# EAGLE design untitled (EAGLE 6.1)
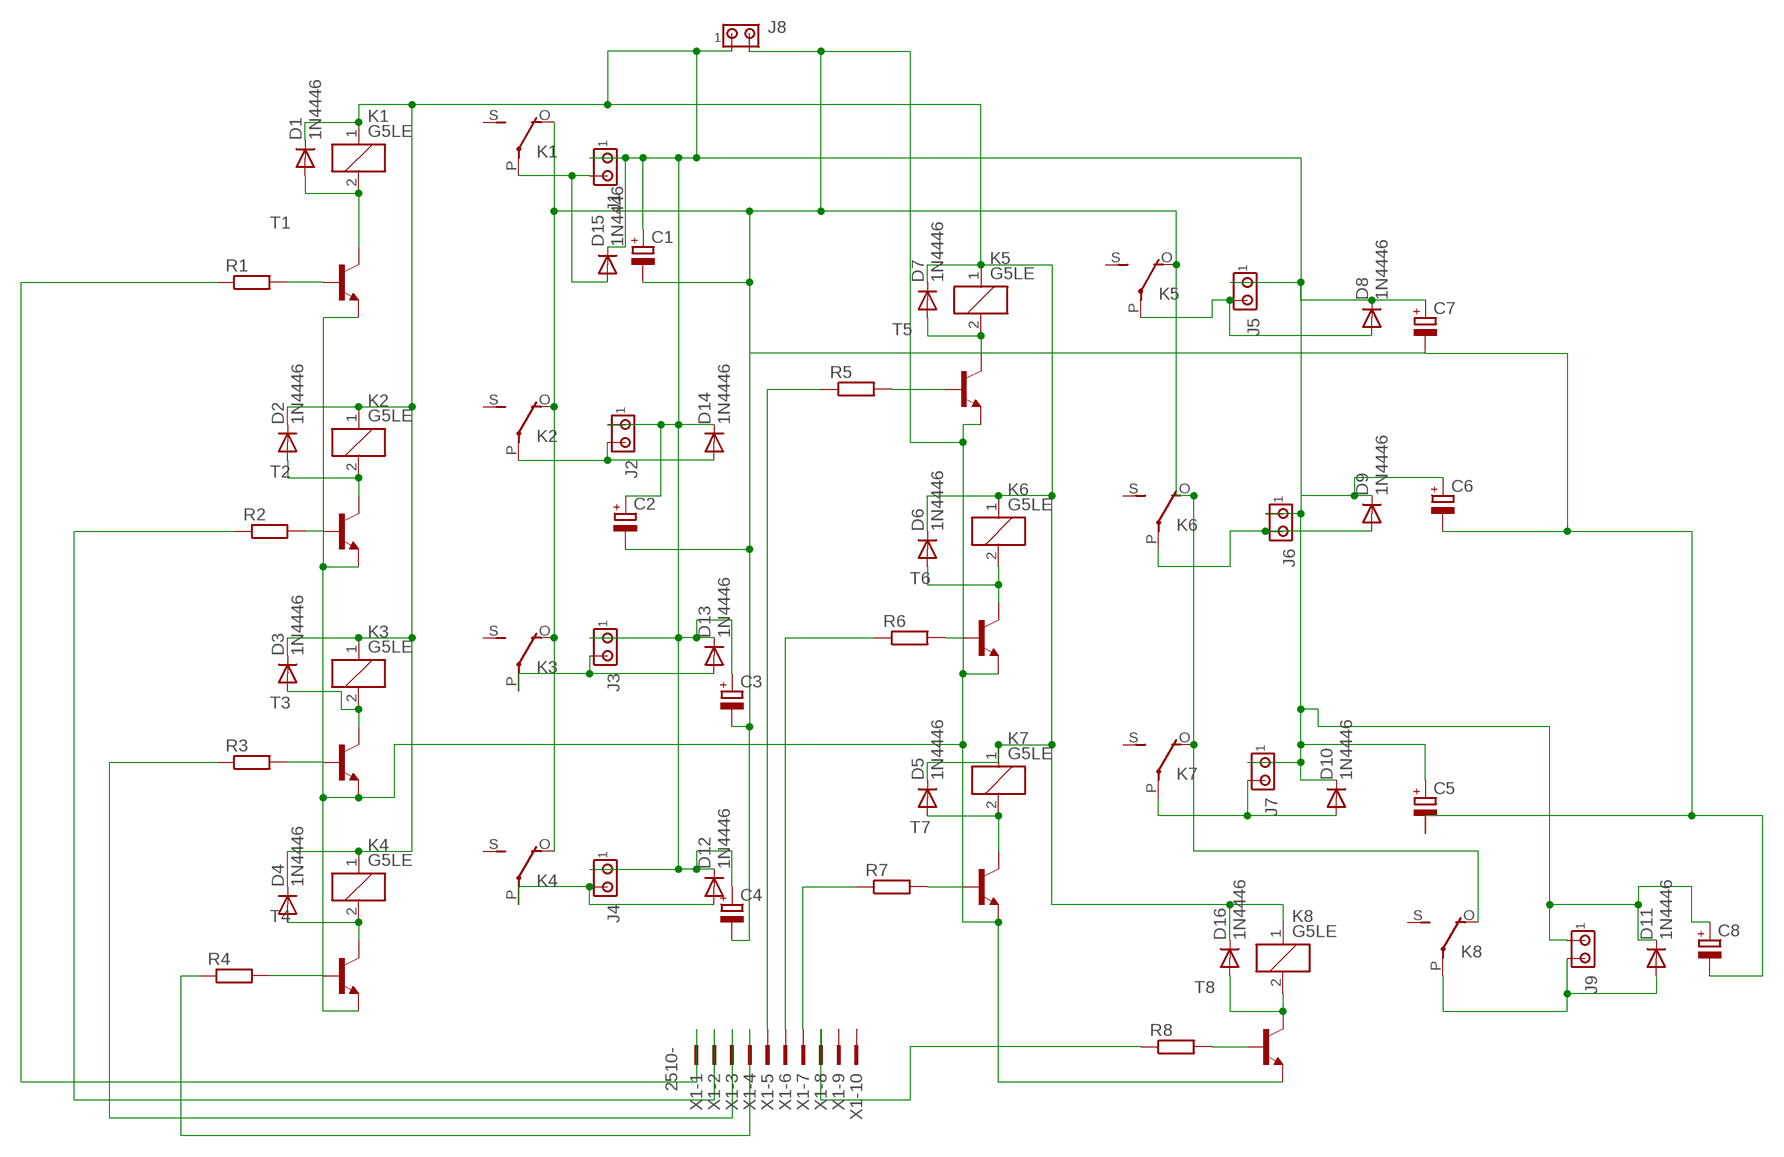
[diagram p0: schematic, sheet 1]

## Parts
C1  CPOL-EUE5-10.5  [E5-10,5]
C2  CPOL-EUE5-10.5  [E5-10,5]
C3  CPOL-EUE5-10.5  [E5-10,5]
C4  CPOL-EUE5-10.5  [E5-10,5]
C5  CPOL-EUE5-10.5  [E5-10,5]
C6  CPOL-EUE5-10.5  [E5-10,5]
C7  CPOL-EUE5-10.5  [E5-10,5]
C8  CPOL-EUE5-10.5  [E5-10,5]
D1  1N4446  [DO35-10]
D2  1N4446  [DO35-10]
D3  1N4446  [DO35-10]
D4  1N4446  [DO35-10]
D5  1N4446  [DO35-10]
D6  1N4446  [DO35-10]
D7  1N4446  [DO35-10]
D8  1N4446  [DO35-10]
D9  1N4446  [DO35-10]
D10  1N4446  [DO35-10]
D11  1N4446  [DO35-10]
D12  1N4446  [DO35-10]
D13  1N4446  [DO35-10]
D14  1N4446  [DO35-10]
D15  1N4446  [DO35-10]
D16  1N4446  [DO35-10]
J1  MTA02-156  [1X2MTA]
J2  MTA02-156  [1X2MTA]
J3  MTA02-156  [1X2MTA]
J4  MTA02-156  [1X2MTA]
J5  MTA02-156  [1X2MTA]
J6  MTA02-156  [1X2MTA]
J7  MTA02-156  [1X2MTA]
J8  MTA02-156  [1X2MTA]
J9  MTA02-156  [1X2MTA]
K1  G5LE  [G5LE]
K2  G5LE  [G5LE]
K3  G5LE  [G5LE]
K4  G5LE  [G5LE]
K5  G5LE  [G5LE]
K6  G5LE  [G5LE]
K7  G5LE  [G5LE]
K8  G5LE  [G5LE]
R1  R-EU_0207/10  [0207/10]
R2  R-EU_0207/10  [0207/10]
R3  R-EU_0207/10  [0207/10]
R4  R-EU_0207/10  [0207/10]
R5  R-EU_0207/10  [0207/10]
R6  R-EU_0207/10  [0207/10]
R7  R-EU_0207/10  [0207/10]
R8  R-EU_0207/10  [0207/10]
T1  2N5401-NPN-TO92-CBE  [TO92-CBE]
T2  2N5401-NPN-TO92-CBE  [TO92-CBE]
T3  2N5401-NPN-TO92-CBE  [TO92-CBE]
T4  2N5401-NPN-TO92-CBE  [TO92-CBE]
T5  2N5401-NPN-TO92-CBE  [TO92-CBE]
T6  2N5401-NPN-TO92-CBE  [TO92-CBE]
T7  2N5401-NPN-TO92-CBE  [TO92-CBE]
T8  2N5401-NPN-TO92-CBE  [TO92-CBE]
X1  2510-  [PAK100/2500-10]

## Nets
N$1: D4.A K4.2 T4.C
N$2: R4.2 T4.B
N$3: R3.2 T3.B
N$4: D3.A K3.2 T3.C
N$5: D2.A K2.2 T2.C
N$6: R2.2 T2.B
N$7: D1.A K1.2 T1.C
N$8: R1.2 T1.B
N$9: R5.2 T5.B
N$10: D7.A K5.2 T5.C
N$11: R6.2 T6.B
N$12: D6.A K6.2 T6.C
N$13: D5.A K7.2 T7.C
N$14: R7.2 T7.B
N$15: R8.2 T8.B
N$16: D11.A J9.2 K8.P(2:P)
N$17: D14.A J2.2 K2.P(2:P)
N$18: R1.1 X1.1
N$19: R2.1 X1.2
N$20: R3.1 X1.3
N$21: R4.1 X1.4
N$22: R7.1 X1.7
N$23: R6.1 X1.6
N$24: R5.1 X1.5
N$25: D13.A J3.2 K3.P(2:P)
N$26: D8.A J5.2 K5.P(2:P)
N$27: D9.A J6.2 K6.P(2:P)
N$28: D10.A J7.2 K7.P(2:P)
N$29: D15.A J1.2 K1.P(2:P)
N$30: D12.A J4.2 K4.P(2:P)
N$31: D16.A K8.2 T8.C
N$32: C1.- C2.- C3.- C4.- C5.- C6.- C7.- C8.- J8.2 K1.O(2:O) K2.O(2:O) K3.O(2:O) K4.O(2:O) K5.O(2:O) K6.O(2:O) K7.O(2:O) K8.O(2:O) T1.E T2.E T3.E T4.E T5.E T6.E T7.E T8.E
N$33: R8.1 X1.8
N$34: C1.+ C2.+ C3.+ C4.+ C5.+ C6.+ C7.+ C8.+ D1.C D2.C D3.C D4.C D5.C D6.C D7.C D8.C D9.C D10.C D11.C D12.C D13.C D14.C D15.C D16.C J1.1 J2.1 J3.1 J4.1 J5.1 J6.1 J7.1 J8.1 J9.1 K1.1 K2.1 K3.1 K4.1 K5.1 K6.1 K7.1 K8.1
Unconnected: K1.S(2:S) K2.S(2:S) K3.S(2:S) K4.S(2:S) K5.S(2:S) K6.S(2:S) K7.S(2:S) K8.S(2:S) X1.9 X1.10

## Library data of the parts
C1-C8 = qfm-trx1-24g:CPOL-EU: POLARIZED CAPACITOR, European symbol
D1-D16 = diode:1N4446: DIODE high speed (Philips)
J1-J9 = con-amp:MTA02-156: AMP connector
K1-K8 = relay:G5LE: RELAY 1 x switch, 10 A/120 V AC, 8 A/30 V DC, Omron; OC_FARNELL: unknown; OC_NEWARK: unknown
R1-R8 = resistor:R-EU_: RESISTOR, European symbol
T1-T8 = transistor:*-NPN-: NPN Transistror BF959 corrected 2008.03.06
X1 = con-3m:2510-: 3M (TM) Pak 100 4-Wall Header Source: 3M; MF: 3M; MPN: 2510-6002UB; OC_FARNELL: 9838244; OC_NEWARK: 46F4725

## Board
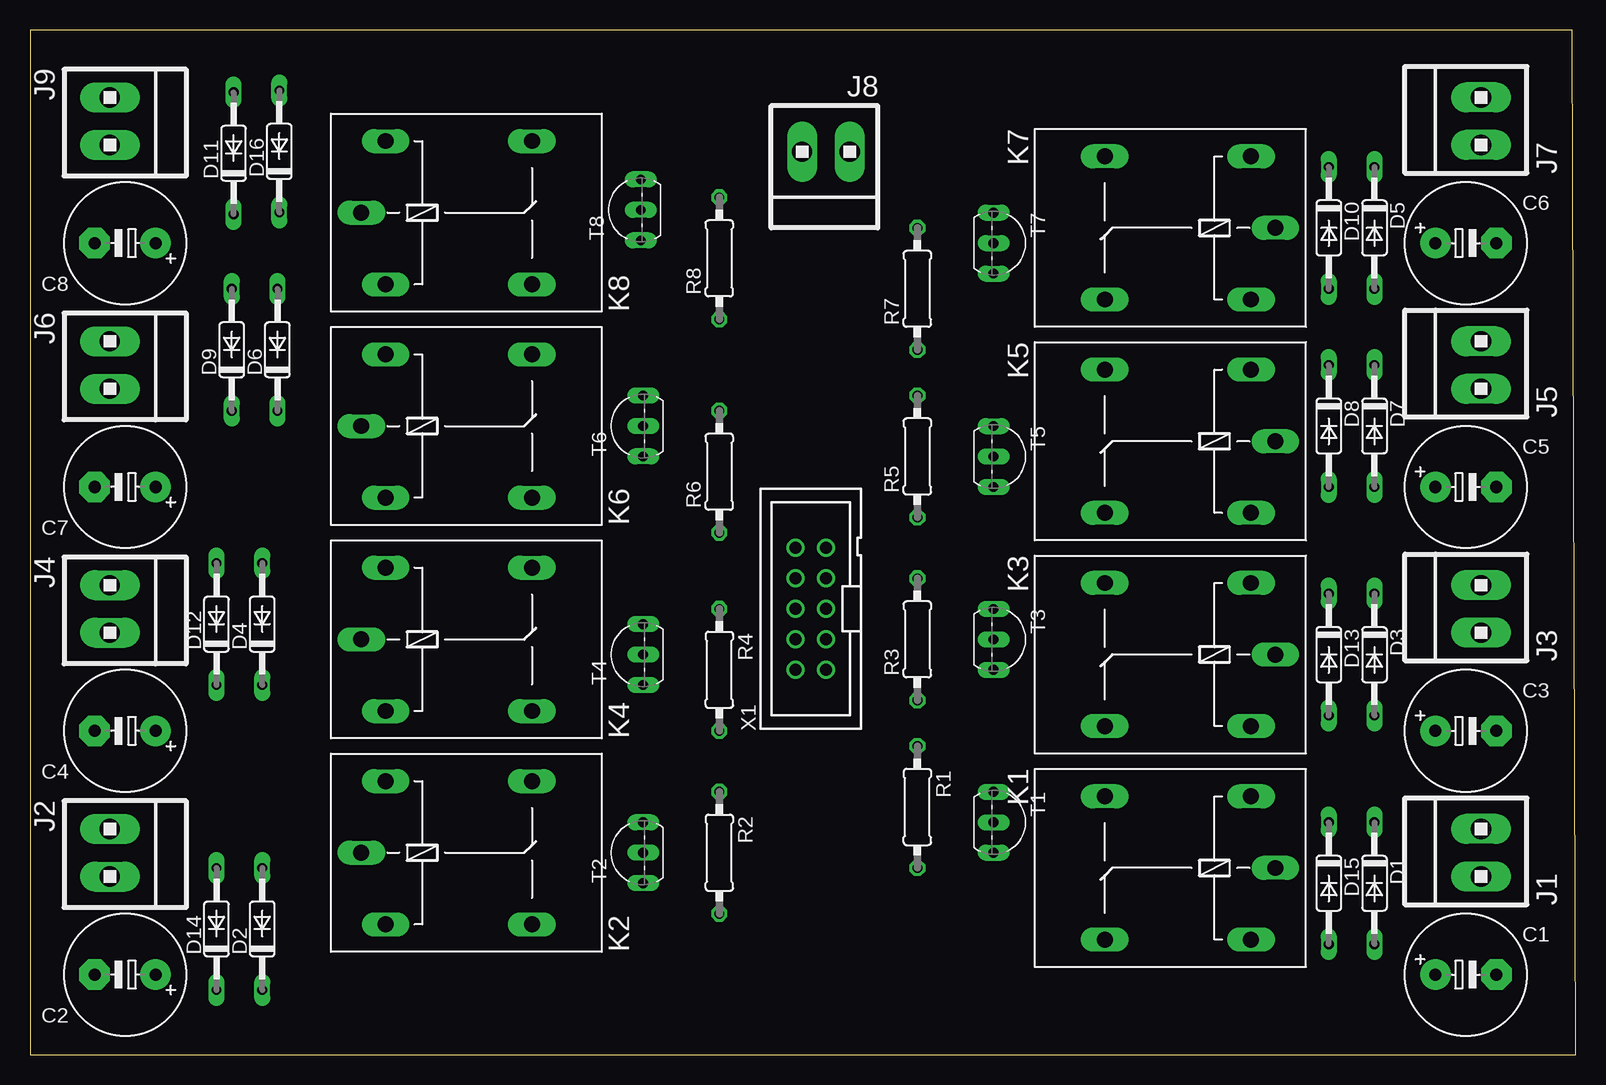
[diagram p1: board, top side]
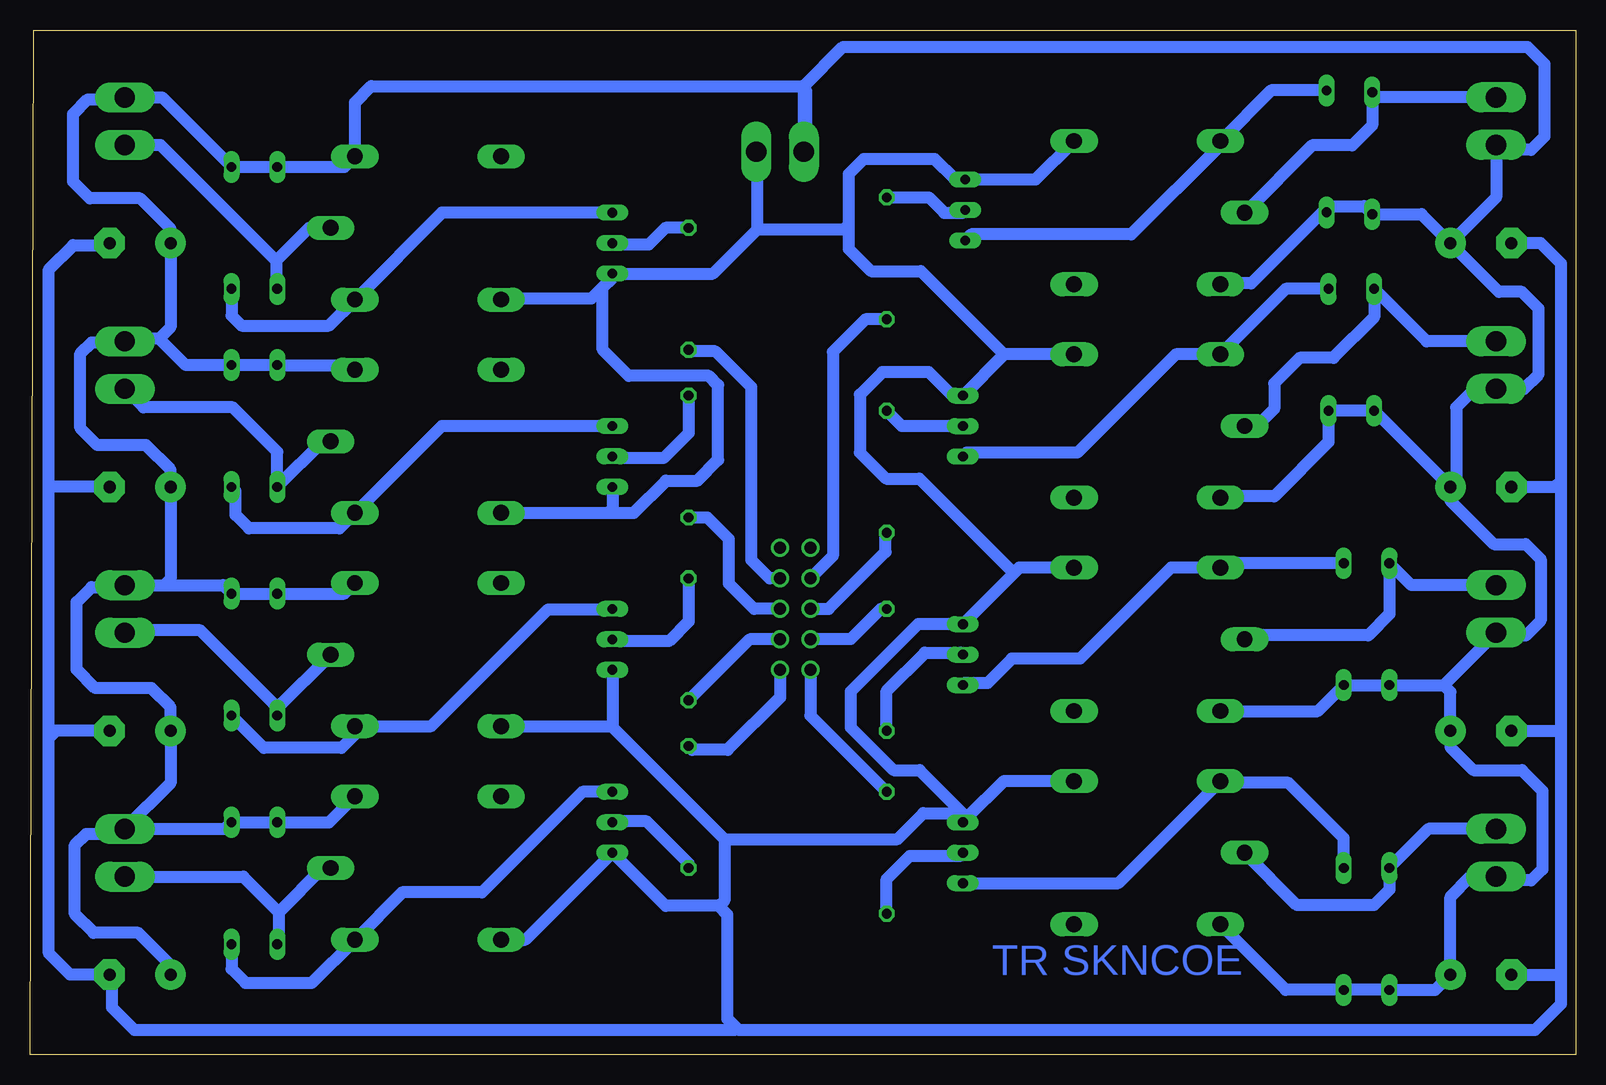
[diagram p2: board, bottom side, seen from below]

Size 128.87 x 85.38 mm. Coordinates in mm from the lower left corner, seen from the top.
Outline: 0,0 128.87,0 128.56,85.38 0,85.38 0,0
Copper layers (1*16): Top 0.035mm / dielectric 1.5mm / Bottom 0.035mm
Design rules: minimum track width 10mil, minimum drill 24mil, track to track 8mil, track to pad 8mil, pad to pad 8mil, via to via 8mil, smd to smd 8mil, copper to edge 40mil, drill to drill 8mil, minimum pad ring 10mil, minimum via ring 8mil, stop-mask expansion 4mil, vias tented up to drill 0mil, thermal gap 10mil

### Footprints (pad centres in the part's own frame; a part is rotated, then mirrored left to right if it is on the bottom)
E5-10,5 = drill 1.016 pad 2.54: + -2.54,0 | drill 1.016 pad 2.54 octagon: - 2.54,0
DO35-10 = drill 0.813 long: A 5.08,0; C -5.08,0
1X2MTA = drill 1.676 long: 1 1.981,0; 2 -1.981,0
G5LE = drill 1.321 long: 1 -7.493,-5.969; 2 -7.493,5.969; O 4.699,5.969; P -9.525,0; S 4.699,-5.969
0207/10 = drill 0.813 octagon: 1 -5.08,0; 2 5.08,0
TO92-CBE = drill 0.813 long: B 0,0; C -2.54,0; E 2.54,0
PAK100/2500-10 = drill 1 pad 1.422: 1 -5.08,-1.27; 2 -5.08,1.27; 3 -2.54,-1.27; 4 -2.54,1.27; 5 0,-1.27; 6 0,1.27; 7 2.54,-1.27; 8 2.54,1.27; 9 5.08,-1.27; 10 5.08,1.27

### Placement (x,y rotation side)
C1  119.69,6.66 0 top
C2  7.93,6.66 180 top
C3  119.69,26.98 0 top
C4  7.93,26.98 180 top
C5  119.69,47.3 0 top
C6  119.69,67.62 0 top
C7  7.93,47.3 180 top
C8  7.93,67.62 180 top
D1  112.07,14.28 270 top
D2  19.36,10.47 90 top
D3  112.07,33.33 270 top
D4  19.36,35.87 90 top
D5  112.07,68.89 270 top
D6  20.63,58.73 90 top
D7  112.07,52.38 270 top
D8  108.26,52.38 270 top
D9  16.82,58.73 90 top
D10  108.26,68.89 270 top
D11  16.98,75.11 90 top
D12  15.55,35.87 90 top
D13  108.26,33.33 270 top
D14  15.55,10.47 90 top
D15  108.26,14.28 270 top
D16  20.79,75.27 90 top
J1  120.96,16.82 90 top
J2  6.66,16.82 270 top
J3  120.96,37.14 90 top
J4  6.66,37.14 270 top
J5  120.96,57.46 90 top
J6  6.66,57.46 270 top
J7  120.96,77.78 90 top
J8  66.35,75.24 180 top
J9  6.66,77.78 270 top
K1  94.29,15.55 180 top
K2  37.14,16.82 0 top
K3  94.29,33.33 180 top
K4  37.14,34.6 0 top
K5  94.29,51.11 180 top
K6  37.14,52.38 0 top
K7  94.29,68.89 180 top
K8  37.14,70.16 0 top
R1  73.97,20.63 270 top
R2  57.46,16.82 270 top
R3  73.97,34.6 90 top
R4  57.46,32.06 270 top
R5  73.97,49.84 90 top
R6  57.46,48.57 90 top
R7  73.97,63.81 90 top
R8  57.46,66.35 90 top
T1  80.32,19.36 270 top
T2  51.11,16.82 90 top
T3  80.32,34.6 270 top
T4  51.11,33.33 90 top
T5  80.32,49.84 270 top
T6  51.11,52.38 90 top
T7  80.32,67.62 270 top
T8  50.91,70.39 90 top
X1  65.08,37.14 90 top

### Tracks (layer width: path | path; a pad name or v marks a point on that pad's centre or on a via)
N$1
  Bottom 1.016: D4.A 29.27,40.95 K4.2 33.76,40.57 41.34,32.99 47.02,32.99 49.05,30.96 50.94,30.96 T4.C
N$2
  Bottom 1.016: R4.2 57.46,30.32 54.28,33.5 51.28,33.5 T4.B
N$3
  Bottom 1.016: R3.2 73.97,36.09 75.61,34.45 80.17,34.45 T3.B
N$4
  Bottom 1.016: D3.A 109.38,25.56 102.9,25.56 101.78,26.68 K3.2 95.42,27.36 85.68,37.1 80.36,37.1 T3.C
N$5
  Bottom 1.016: D2.A 19.36,18.04 23.96,22.64 29.5,22.64 K2.2 38.16,14.28 T2.C
N$6
  Bottom 1.016: R2.2 57.46,14.62 55.52,16.56 51.37,16.56 T2.B
N$7
  Bottom 1.016: D1.A 112.07,7.15 110.9,5.97 105.39,5.97 K1.2 97.85,13.51 91.2,13.51 82.81,21.9 T1.C
N$8
  Bottom 1.016: R1.2 73.97,15.93 77.47,19.43 80.26,19.43 T1.B
N$9
  Bottom 1.016: R5.2 73.97,51.8 76.06,49.71 80.19,49.71 T5.B
N$10
  Bottom 1.016: T5.C 94.54,52.38 K5.2 103.07,43.86 110.61,43.86 111.74,44.98 111.74,46.97 D7.A
N$11
  Bottom 1.016: T6.B 56.19,52.38 R6.2
N$12
  Bottom 1.016: D6.A 24.19,63.81 K6.2 33.37,58.35 41.11,50.61 | 41.11,50.61 | 41.11,50.61 41.56,50.16 50.79,50.16 T6.C
N$13
  Bottom 1.016: D5.A 112.07,61.58 111.23,60.74 103.96,60.74 K7.2 94.54,70.16 T7.C
N$14
  Bottom 1.016: R7.2 75.9,68.89 77.3,67.5 80.2,67.5 T7.B
N$15
  Bottom 1.016: R8.2 53.94,71.43 52.65,70.14 51.15,70.14 T8.B
N$16
  Bottom 1.016: K8.P 22.01,75.77 18.65,75.77 16.98,77.44 D11.A 16.55,79.76 J9.2
N$17
  Bottom 1.016: J2.2 12.3,18.8 D14.A 15.55,13.75 16.84,12.46 23.26,12.46 K2.P
N$18
  Bottom 1.016: X1.1 66.35,29.76 70.71,25.39 73.65,25.39 R1.1
N$19
  Bottom 1.016: X1.2 63.81,28.25 R2.1
N$20
  Bottom 1.016: X1.3 68.89,34.6 R3.1
N$21
  Bottom 1.016: R4.1 57.95,37.14 60.47,34.62 63.79,34.62 X1.4
N$22
  Bottom 1.016: X1.7 67.22,39.68 68.74,41.21 68.74,55.62 71.73,58.6 73.84,58.6 R7.1
N$23
  Bottom 1.016: X1.6 62.29,37.14 57.54,41.89 57.54,43.41 R6.1
N$24
  Bottom 1.016: X1.5 68.5,37.14 70.6,39.24 70.6,42.96 72.4,44.76 R5.1
N$25
  Bottom 1.016: K3.P 108.26,28.89 D13.A 108.26,28.95 114.67,35.36 120.77,35.36 J3.2
N$26
  Bottom 1.016: K5.P 104.45,51.11 D8.A 108.26,50.23 111.96,53.93 119.41,53.93 J5.2
N$27
  Bottom 1.016: J6.2 12.45,59.44 D9.A 16.82,61.46 20.21,58.06 23.04,58.06 25.16,55.94 25.16,53.82 26.52,52.46 27.54,52.46 K6.P
N$28
  Bottom 1.016: J7.2 118.02,75.8 108.36,66.15 | 108.36,66.15 108.36,63.91 D10.A | K7.P 105.62,68.89 108.36,66.15
N$29
  Bottom 1.016: K1.P 104.47,15.55 108.14,11.88 | 108.14,11.88 108.14,9.32 D15.A | J1.2 111.1,14.84 108.14,11.88
N$30
  Bottom 1.016: J4.2 13.72,39.12 D12.A 15.55,36.72 17.33,34.94 27.28,34.94 K4.P
N$31
  Bottom 1.016: T8.C 50.41,68.34 37.06,68.34 29.65,75.75 K8.2 25.43,80.35 D16.A
N$32
  Bottom 1.016: K2.O 47.68,22.79 50.75,19.72 | 50.75,19.72 T2.E | K4.O 46.41,40.57 46.86,40.12 | 46.86,40.12 T4.E 54.83,35.87 60.47,30.24 60.47,27.27 56.89,23.7 54.72,23.7 51.22,20.19 | K6.O 47.68,58.35 | 47.68,58.35 T6.E 51.99,54.92 53.94,56.87 57.82,56.87 59.69,55 59.69,50.17 57.51,47.99 54.73,47.99 46.86,40.12 | K8.O 45.04,72.93 T8.E 51.77,72.93 53.47,74.62 59.38,74.62 60.62,73.38 60.62,69.17 | K1.O 87.56,9.58 T1.E 75.89,12.39 71.45,12.39 | K3.O 80.4,27.36 80.32,27.29 | 80.32,27.29 70.99,17.96 | 70.99,17.96 70.99,12.84 71.45,12.39 | T3.E 80.32,27.29 | K5.O 80.67,45.14 | 80.67,45.14 78.55,45.14 75.86,47.84 73.22,47.84 71.5,49.55 71.5,55.78 72.28,56.56 78.96,56.56 81.14,58.74 81.14,63.93 | 81.14,63.93 82.08,62.99 89.52,62.99 K7.O | 68.24,68.79 71.95,65.08 T7.E 80.32,64.76 81.14,63.93 | 68.24,68.79 68.24,75.15 J8.2 | 127.31,26.34 127.31,8.43 125.54,6.66 C1.- 122.02,6.45 122.02,3.91 120.16,2.05 70.1,2.05 69.95,2.21 | 127.31,26.34 127.31,47.21 | 127.31,47.21 127.31,65.44 125.29,67.46 122.39,67.46 C6.- | C5.- 127.22,47.3 127.31,47.21 | 127.31,26.34 126.67,26.98 C3.- 127.01,26.98 127.15,27.12 | C2.- 1.35,6.66 1.24,6.77 | 1.24,6.77 1.24,4.22 3.42,2.05 69.79,2.05 69.95,2.21 | 1.24,6.77 1.24,26.81 | 1.24,26.81 1.24,26.97 | 1.24,26.97 1.24,47.84 | 1.24,47.84 1.24,65.91 2.95,67.62 C8.- | C7.- 1.78,47.3 1.24,47.84 | 1.24,26.81 1.41,26.98 C4.- 1.26,26.98 1.24,26.97 | 60.62,69.17 60.62,67.15 58.76,65.28 54.61,65.28 47.68,58.35 | 68.24,68.79 61,68.79 60.62,69.17 | 51.22,20.19 50.75,19.72 | 70.99,17.96 56.56,17.96 54.4,20.11 51.3,20.11 51.22,20.19 | 69.95,2.21 70.73,2.98 70.73,11.67 71.45,12.39 | T5.E 80.32,45.5 80.67,45.14
N$33
  Bottom 1.016: R8.1 59.23,61.27 61.94,58.57 61.94,41.56 X1.8
N$34
  Bottom 1.016: K2.1 24.19,5.39 D2.C D14.C 11.74,5.39 C2.+ 10.47,13.13 8.79,14.8 6.7,14.8 J2.1 6.33,14.51 3.73,14.51 2.8,15.44 2.8,21.98 4.51,23.7 8.55,23.7 10.47,25.62 C4.+ 10.47,30.23 11.03,30.79 | K4.1 21.52,28.63 D4.C D12.C 11.03,30.79 | 11.03,30.79 J4.1 6.41,34.91 4.2,34.91 2.95,36.15 2.95,41.3 4.2,42.54 6.84,42.54 10.47,46.17 C7.+ | C7.+ D9.C D6.C 20.63,51.06 25.16,46.53 29.53,46.53 K6.1 | C7.+ 9.99,47.78 9.99,53.93 8.44,55.48 J6.1 4.34,55.48 3.11,56.71 3.11,62.17 4.51,63.57 6.42,63.57 C8.+ | D16.C 20.63,70.7 | 20.63,70.7 27.06,64.27 29.57,64.27 K8.1 | J1.1 112.63,18.8 D1.C D15.C 103.94,19.36 K1.1 | 117.67,39.12 J3.1 121.12,38.96 123.73,38.96 124.98,37.72 124.98,32.11 123.42,30.55 118.76,30.55 117.15,28.94 C3.+ 117.15,22.61 J1.1 | 117.67,39.12 112.78,39.12 D3.C D13.C 102.67,38.41 K3.1 | 118.1,59.67 115.89,57.46 D7.C D8.C 102.16,57.46 K5.1 | 118.1,59.67 120.73,59.67 J5.1 121.04,59.36 123.73,59.36 124.67,58.43 124.67,52.2 123.26,50.8 119.22,50.8 117.15,48.72 C5.+ 117.15,39.64 117.67,39.12 | C1.+ 117.15,7.45 119.85,10.15 123.57,10.15 125.13,11.7 125.13,17.47 124.2,18.4 121.36,18.4 J1.1 | 118.1,59.67 117.15,60.62 C6.+ 117.15,68.81 119.69,71.35 123.89,71.35 125.29,72.76 125.29,78.37 124.04,79.61 121.11,79.61 J7.1 117.86,79.76 D5.C D10.C 102.67,73.97 K7.1 101.78,79.33 100.42,80.7 64.51,80.7 64.2,80.39 64.2,75.41 J8.1 64.37,80.69 61.09,83.97 4.04,83.97 2.64,82.57 2.64,76.49 3.73,75.4 6.26,75.4 J9.1 6.66,71.43 C8.+ | 20.63,70.7 17.65,70.7 D11.C 12.88,70.03 C8.+

### Text on the board
Bottom: TR SKNCOE